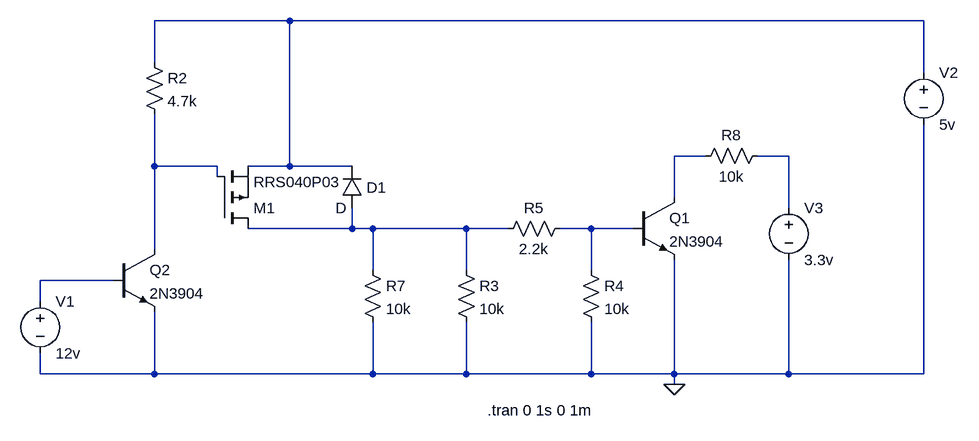
[diagram p0: schematic Prob 1_Before.asc]
Prob 1_Before.asc, the LTspice schematic file:
Version 4
SHEET 1 1096 680
WIRE 64 -112 -144 -112
WIRE 1040 -112 64 -112
WIRE -144 -48 -144 -112
WIRE 1040 -32 1040 -112
WIRE 704 96 656 96
WIRE 832 96 784 96
WIRE -144 112 -144 32
WIRE -48 112 -144 112
WIRE 64 112 64 -112
WIRE 64 112 0 112
WIRE 160 112 64 112
WIRE -48 128 -48 112
WIRE 656 160 656 96
WIRE 832 176 832 96
WIRE 160 208 160 176
WIRE 160 208 0 208
WIRE 192 208 160 208
WIRE 336 208 192 208
WIRE 400 208 336 208
WIRE 528 208 480 208
WIRE 592 208 528 208
WIRE -144 240 -144 112
WIRE 192 272 192 208
WIRE 336 272 336 208
WIRE 528 272 528 208
WIRE -208 288 -320 288
WIRE -320 320 -320 288
WIRE -320 432 -320 400
WIRE -144 432 -144 336
WIRE -144 432 -320 432
WIRE 192 432 192 352
WIRE 192 432 -144 432
WIRE 336 432 336 352
WIRE 336 432 192 432
WIRE 528 432 528 352
WIRE 528 432 336 432
WIRE 656 432 656 256
WIRE 656 432 528 432
WIRE 832 432 832 256
WIRE 832 432 656 432
WIRE 1040 432 1040 48
WIRE 1040 432 832 432
WIRE 656 448 656 432
FLAG 656 448 0
SYMBOL res -160 -64 R0
SYMATTR InstName R2
SYMATTR Value 4.7k
SYMBOL npn 592 160 R0
SYMATTR InstName Q1
SYMATTR Value 2N3904
SYMBOL res 496 192 R90
WINDOW 0 0 56 VBottom 2
WINDOW 3 32 56 VTop 2
SYMATTR InstName R5
SYMATTR Value 2.2k
SYMBOL voltage -320 304 R0
WINDOW 123 0 0 Left 0
WINDOW 39 0 0 Left 0
SYMATTR InstName V1
SYMATTR Value 12v
SYMBOL voltage 1040 -48 R0
WINDOW 123 0 0 Left 0
WINDOW 39 0 0 Left 0
SYMATTR InstName V2
SYMATTR Value 5v
SYMBOL res 320 256 R0
SYMATTR InstName R3
SYMATTR Value 10k
SYMBOL res 512 256 R0
SYMATTR InstName R4
SYMATTR Value 10k
SYMBOL voltage 832 160 R0
WINDOW 123 0 0 Left 0
WINDOW 39 0 0 Left 0
SYMATTR InstName V3
SYMATTR Value 3.3v
SYMBOL pmos -48 208 M180
SYMATTR InstName M1
SYMATTR Value RRS040P03
SYMBOL res 176 256 R0
SYMATTR InstName R7
SYMATTR Value 10k
SYMBOL res 800 80 R90
WINDOW 0 0 56 VBottom 2
WINDOW 3 32 56 VTop 2
SYMATTR InstName R8
SYMATTR Value 10k
SYMBOL npn -208 240 R0
SYMATTR InstName Q2
SYMATTR Value 2N3904
SYMBOL diode 176 176 R180
WINDOW 0 -37 31 Left 2
WINDOW 3 24 0 Left 2
SYMATTR InstName D1
TEXT 368 488 Left 2 !.tran 0 1s 0 1m

The netlist it stands for:
* Prob 1_Before.asc
R2 N001 N004 4.7k
Q1 N002 N006 0 0 2N3904
R5 N006 N005 2.2k
V1 N007 0 12v
V2 N001 0 5v
R3 N005 0 10k
R4 N006 0 10k
V3 N003 0 3.3v
M1 N005 N004 N001 N001 RRS040P03
R7 N005 0 10k
R8 N003 N002 10k
Q2 N004 N007 0 0 2N3904
D1 N005 N001 D
.model D D
.lib standard.dio
.model NPN NPN
.model PNP PNP
.lib standard.bjt
.model NMOS NMOS
.model PMOS PMOS
.lib standard.mos
.tran 0 1s 0 1m
.backanno
.end